# Altium schematic sheet Source Selection.SchDoc
size A3
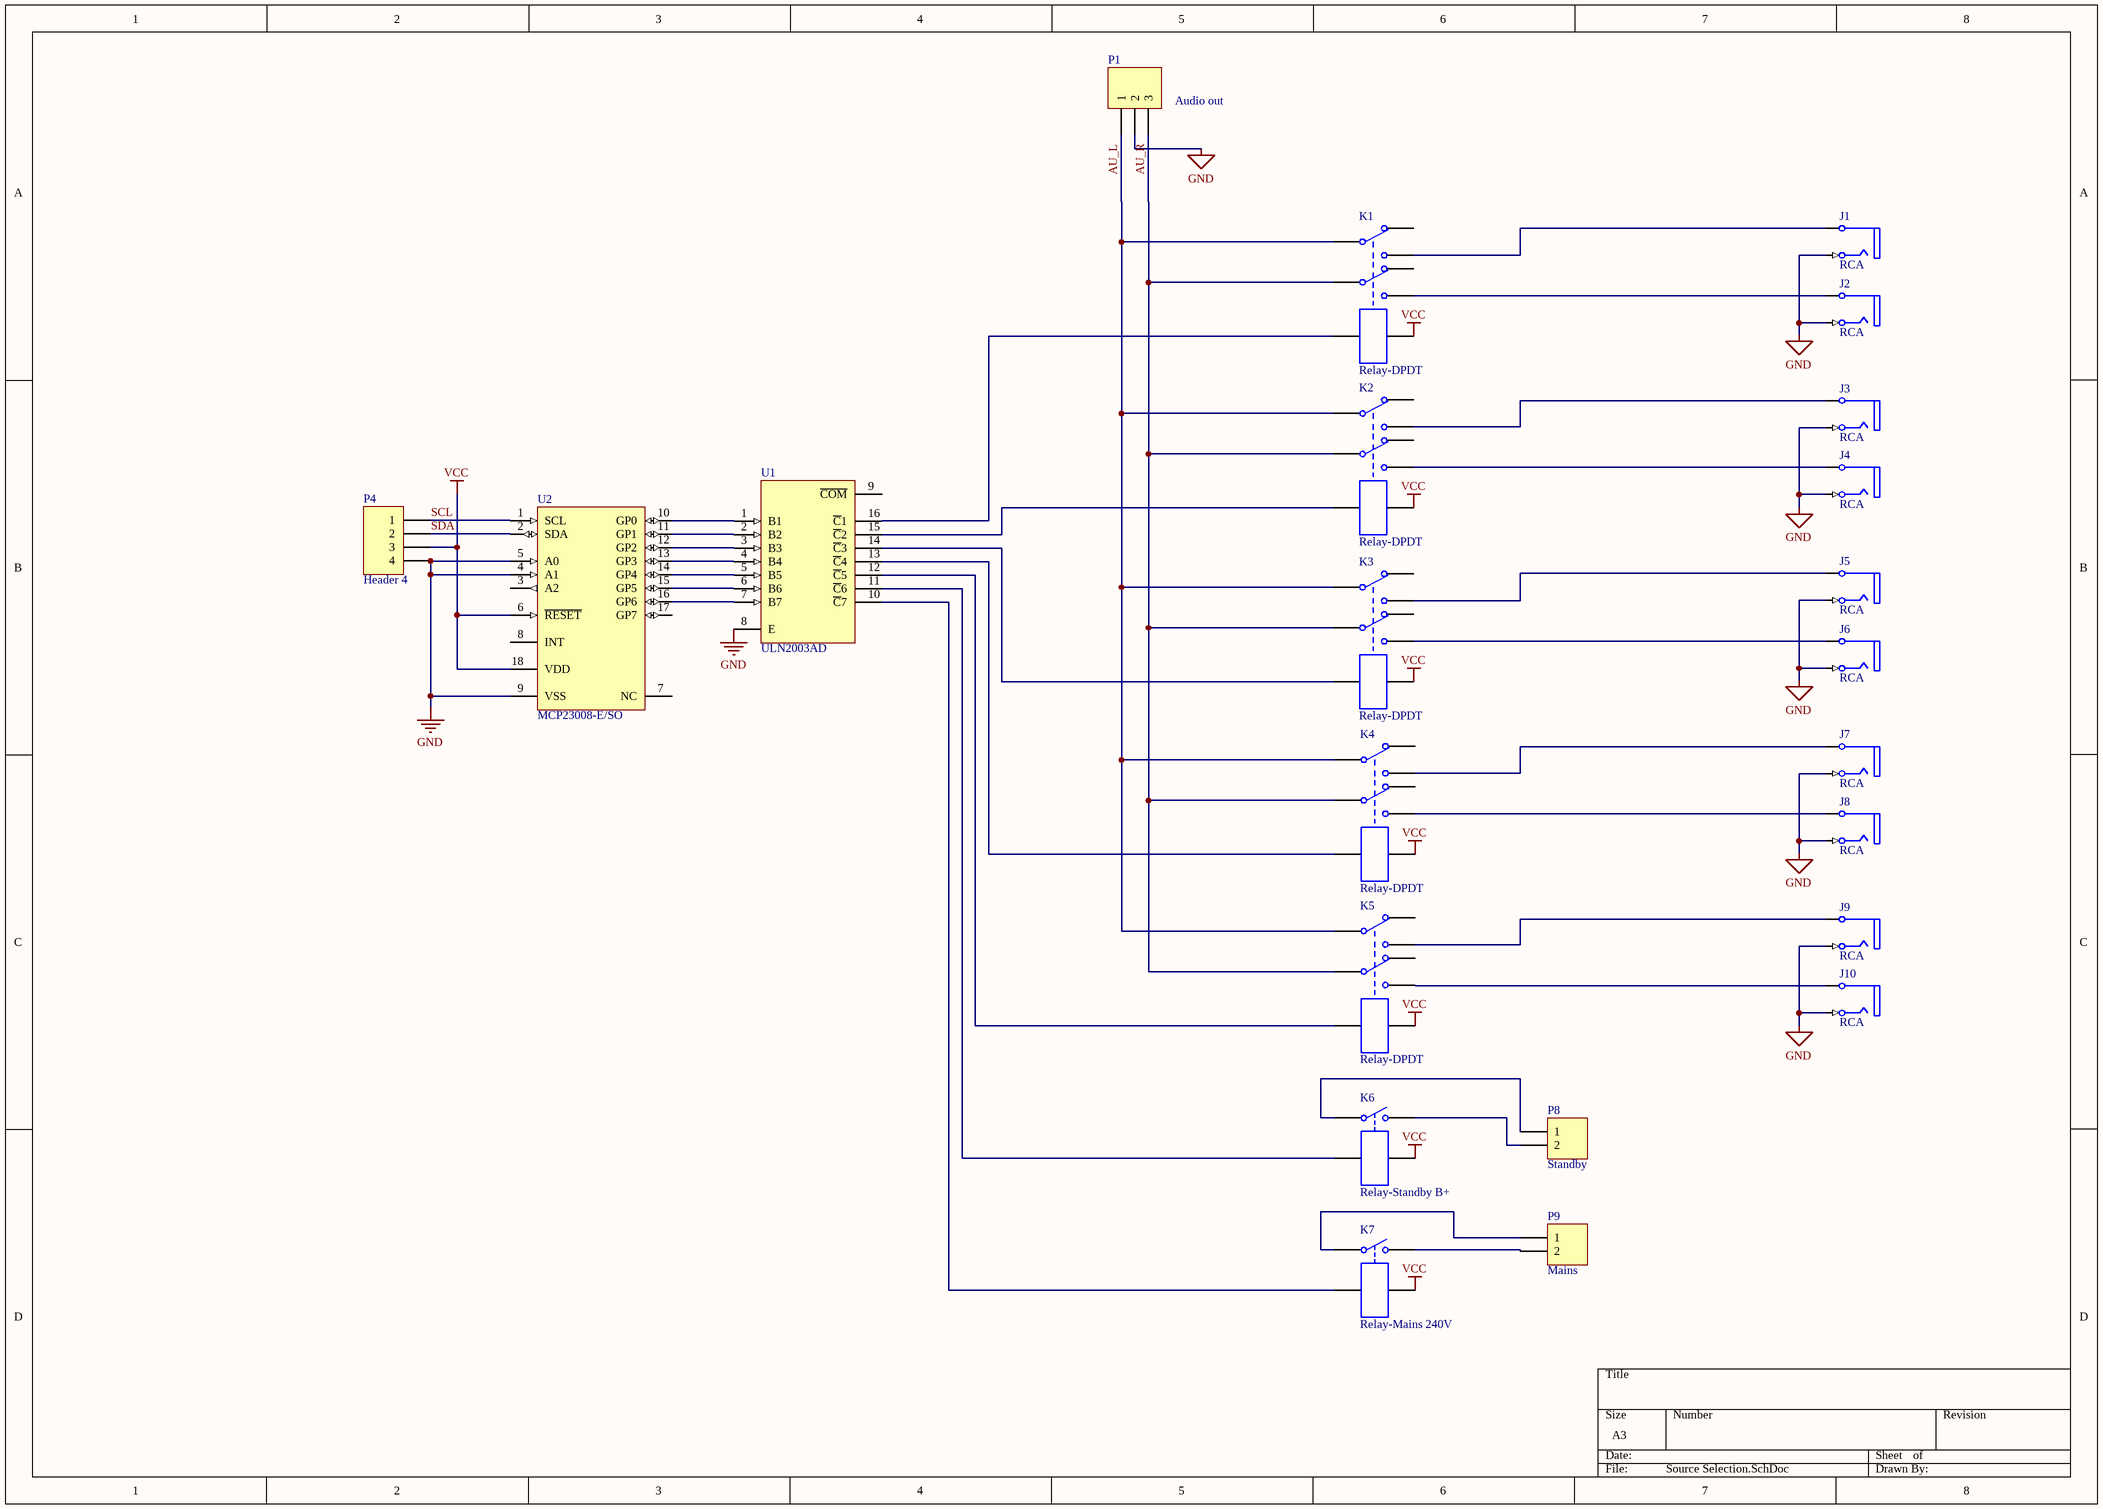
[diagram p0: Source Selection.SchDoc]

## Parts
J1  RCA  [RCA/4.5-H2]
J2  RCA  [RCA/4.5-H2]
J3  RCA  [RCA/4.5-H2]
J4  RCA  [RCA/4.5-H2]
J5  RCA  [RCA/4.5-H2]
J6  RCA  [RCA/4.5-H2]
J7  RCA  [RCA/4.5-H2]
J8  RCA  [RCA/4.5-H2]
J9  RCA  [RCA/4.5-H2]
J10  RCA  [RCA/4.5-H2]
K1  Relay-DPDT  [DIP-P8]
K2  Relay-DPDT  [DIP-P8]
K3  Relay-DPDT  [DIP-P8]
K4  Relay-DPDT  [DIP-P8]
K5  Relay-DPDT  [DIP-P8]
K6  Relay-Standby B+  [MODULE4]
K7  Relay-Mains 240V  [MODULE4]
P1  Audio out  [PH_TERM_3]
P4  Header 4  [IDC2.54-H10C]
P8  Standby  [PH_TERM_2]
P9  Mains  [HDR1X2]
U1  ULN2003AD  [D016_N]
U2  MCP23008-E/SO  [SOIC-SO18_N]

## Nets
GND: J1.2B(Signal) J2.2B(Signal) J3.2B(Signal) J4.2B(Signal) J5.2B(Signal) J6.2B(Signal) J7.2B(Signal) J8.2B(Signal) J9.2B(Signal) J10.2B(Signal) P1.2 P4.4 U1.8(E) U2.4(A1) U2.5(A0) U2.9(VSS)
VCC: K1.8 K2.8 K3.8 K4.8 K5.8 K6.4 K7.4 P4.3 U2.6(~{RESET}) U2.18(VDD)
AU_L: K1.1 K2.1 K3.1 K4.1 K5.1 P1.1
AU_R: K1.4 K2.4 K3.4 K4.4 K5.4 P1.3
SCL: P4.1 U2.1(SCL)
SDA: P4.2 U2.2(SDA)
NetJ1_1A: J1.1A(Ground) K1.3
NetJ2_1A: J2.1A(Ground) K1.6
NetJ3_1A: J3.1A(Ground) K2.3
NetJ4_1A: J4.1A(Ground) K2.6
NetJ5_1A: J5.1A(Ground) K3.3
NetJ6_1A: J6.1A(Ground) K3.6
NetJ7_1A: J7.1A(Ground) K4.3
NetJ8_1A: J8.1A(Ground) K4.6
NetJ9_1A: J9.1A(Ground) K5.3
NetJ10_1A: J10.1A(Ground) K5.6
NetK1_7: K1.7 U1.16(~{C}1)
NetK2_7: K2.7 U1.15(~{C}2)
NetK3_7: K3.7 U1.14(~{C}3)
NetK4_7: K4.7 U1.13(~{C}4)
NetK5_7: K5.7 U1.12(~{C}5)
NetK6_1: K6.1 P8.1
NetK6_2: K6.2 P8.2
NetK6_3: K6.3 U1.11(~{C}6)
NetK7_1: K7.1 P9.1
NetK7_2: K7.2 P9.2
NetK7_3: K7.3 U1.10(~{C}7)
NetU1_1: U1.1(B1) U2.10(GP0)
NetU1_2: U1.2(B2) U2.11(GP1)
NetU1_3: U1.3(B3) U2.12(GP2)
NetU1_4: U1.4(B4) U2.13(GP3)
NetU1_5: U1.5(B5) U2.14(GP4)
NetU1_6: U1.6(B6) U2.15(GP5)
NetU1_7: U1.7(B7) U2.16(GP6)

Not connected (* = marked no-connect by the designer): K1 2 5; K2 2 5; K3 2 5; K4 2 5; K5 2 5; U1 9(~{COM}); U2 3(A2) 7(NC) 8(INT) 17(GP7)

## Library data of the parts
J1-J10 = RCA: RCA Phono Jack, Right Angle, Thru-Hole, Snap-In; PCB_Layout: Complies with manufacturer's recommendation.; DrillAndSlotSize: Corresponds to nominal value.; Published: 15-Jul-2004; LatestRevisionDate: 15-Jul-2004; LatestRevisionNote: Component Replaced.; DatasheetDocument: 7-Jul-2000; PackageDocument: 7-Jul-2000; PackageReference: 161; Publisher: Altium Limited; ComponentLink1Description: Manufacturer Link; ComponentLink1URL: http://www.mouser.com/kobiconn/
  J1: CAD File: http://www.farnell.com/cad/338008.pdf
K1-K5 = Relay-DPDT: Dual-Pole Dual-Throw Relay; Published: 24-Mar-1999; LatestRevisionDate: 17-Jul-2002; LatestRevisionNote: Re-released for DXP Platform.; PackageReference: DIP-P8; Publisher: Altium Limited; PackageDescription: Relay; 8 Leads
K6 K7 = Relay-SPST: Single-Pole Single-Throw Relay; Published: 24-Mar-1999; LatestRevisionDate: 17-Jul-2002; LatestRevisionNote: Re-released for DXP Platform.; PackageReference: MODULE4; Publisher: Altium Limited
P1 = Header 3: Header, 3-Pin; LatestRevisionDate: 17-Jul-2002; LatestRevisionNote: Re-released for DXP Platform.; Publisher: Altium Limited
P4 = Header 4: Header, 4-Pin; LatestRevisionDate: 17-Jul-2002; LatestRevisionNote: Re-released for DXP Platform.; Publisher: Altium Limited
P8 P9 = Header 2: Header, 2-Pin; LatestRevisionDate: 17-Jul-2002; LatestRevisionNote: Re-released for DXP Platform.; Publisher: Altium Limited
U1 = ULN2003AD: Darlington Transistor Array; Published: 15-May-2002; LatestRevisionDate: 13-Apr-2006; LatestRevisionNote: IPC-7351 Footprint Added.; DatasheetVersion: Sep-1986; PackageVersion: Jan-1998; PackageReference: D016; Publisher: Altium Limited; PackageDescription: 16-Pin Small Outline Integrated Circuit 1.27 mm Pitch; Code_IPC: SOIC127P600-16; ComponentLink1Description: Manufacturer Link; ComponentLink1URL: http://www.ti.com/; ComponentLink2Description: Datasheet; ComponentLink2URL: http://www-s.ti.com/sc/ds/uln2002a.pdf
U2 = MCP23008-E/SO: 8-Bit I/O Expander with Serial Interface, 18-Pin SOIC, Extended Temperature; Published: 29-Jan-2009; DatasheetVersion: revE, Aug-2007; PackageVersion: revBB, Aug-2009; PackageReference: SOIC-SO18; Publisher: Altium Limited; PackageDescription: 18-Lead Plastic Small Outline (SO) - Wide 7.50mm Body [SOIC]; Supplier 1: Digi-Key; Supplier Part Number 1: MCP23008-E/SO-ND; Supplier 2: Farnell; Supplier Part Number 2: 1332086; Code_JEDEC: MS-013; ComponentLink1Description: Datasheet; ComponentLink1URL: http://ww1.microchip.com/downloads/en/DeviceDoc/21919e.pdf; ComponentLink2Description: Packaging Specification; ComponentLink2URL: http://www.microchip.com/stellent/groups/techpub_sg/documents/packagingspec/en012702.pdf; ComponentLink3Description: Microchip.com Home; ComponentLink3URL: http://www.microchip.com/